# EAGLE design WATER LEVEL INDICATOR (EAGLE 7.5.0)
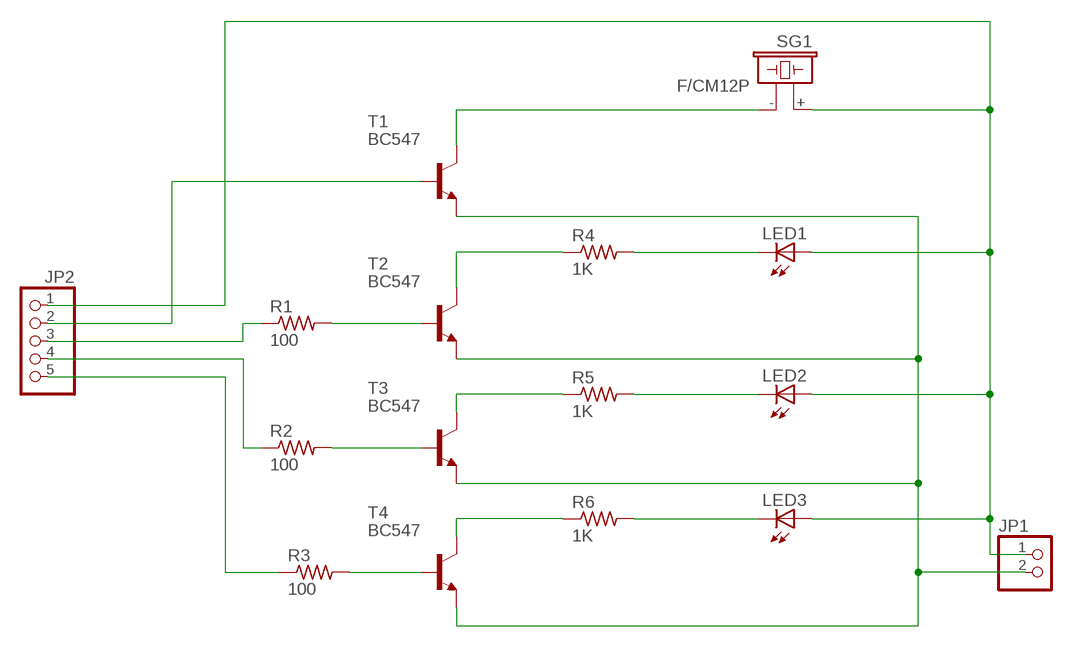
[diagram p0: schematic, sheet 1]

## Parts
JP1  PINHD-1X2  [1X02]
JP2  PINHD-1X5  [1X05]
LED1  LED5MM  [LED5MM]
LED2  LED5MM  [LED5MM]
LED3  LED5MM  [LED5MM]
R1  100  R-US_0207/10  [0207/10]
R2  100  R-US_0207/10  [0207/10]
R3  100  R-US_0207/10  [0207/10]
R4  1K  R-US_0207/10  [0207/10]
R5  1K  R-US_0207/10  [0207/10]
R6  1K  R-US_0207/10  [0207/10]
SG1  F/CM12P  [F/CM12P]
T1  BC547  [TO92]
T2  BC547  [TO92]
T3  BC547  [TO92]
T4  BC547  [TO92]

## Nets
N$1: LED1.K(C) R4.2
N$2: JP2.2 T1.2(B)
N$3: SG1.- T1.3(C)
N$4: JP2.3 R1.1
N$5: R1.2 T2.2(B)
N$6: R4.1 T2.3(C)
N$7: LED2.K(C) R5.2
N$8: JP2.4 R2.1
N$9: R2.2 T3.2(B)
N$10: R5.1 T3.3(C)
N$11: LED3.K(C) R6.2
N$12: JP1.1 JP2.1 LED1.A LED2.A LED3.A SG1.+
N$13: JP2.5 R3.1
N$14: R3.2 T4.2(B)
N$15: R6.1 T4.3(C)
N$17: JP1.2 T1.1(E) T2.1(E) T3.1(E) T4.1(E)

## Library data of the parts
JP1 = pinhead:PINHD-1X2: PIN HEADER
JP2 = pinhead:PINHD-1X5: PIN HEADER
LED1-LED3 = led:LED: LED OSRAM: - CHIPLED LG R971, LG N971, LY N971, LG Q971, LY Q971, LO R971, LY R971 LH N974, LH R974 LS Q976, LO Q976, LY Q976 LO Q996 - Hyper CHIPLED LW Q18S LB Q993, LB Q99A, LB R99A - SideLED LS A670, LO A670, LY A670, LG A670, LP A670 LB A673, LV A673, LT A673, LW A673 LH A674 LY A675 LS A676, LA A676, LO A676, LY A676, LW A676 LS A679, LY A679, LG A679 - Hyper Micro SIDELED® LS Y876, LA Y876, LO Y876, LY Y876 LT Y87S - SmartLED LW L88C, LW L88S LB L89C, LB L89S, LG L890 LS L89K, LO L89K, LY L89K LS L896, LA L896, LO L896, LY L896 - TOPLED LS T670, LO T670, LY T670, LG T670, LP T670 LSG T670, LSP T670, LSY T670, LOP T670, LYG T670 LG T671, LOG T671, LSG T671 LB T673, LV T673, LT T673, LW T673 LH T674 LS T676, LA T676, LO T676, LY T676, LB T676, LH T676, LSB T676, LW T676 LB T67C, LV T67C, LT T67C, LS T67K, LO T67K, LY T67K, LW E67C LS E67B, LA E67B, LO E67B, LY E67B, LB E67C, LV E67C, LT E67C LW T67C LS T679, LY T679, LG T679 LS T770, LO T770, LY T770, LG T770, LP T770 LB T773, LV T773, LT T773, LW T773 LH T774 LS E675, LA E675, LY E675, LS T675 LS T776, LA T776, LO T776, LY T776, LB T776 LHGB T686 LT T68C, LB T68C - Hyper Mini TOPLED® LB M676 - Mini TOPLED Santana® LG M470 LS M47K, LO M47K, LY M47K Source: http://www.osram.convergy.de LUXEON: - LUMILED® LXK2-PW12-R00, LXK2-PW12-S00, LXK2-PW14-U00, LXK2-PW14-V00 LXK2-PM12-R00, LXK2-PM12-S00, LXK2-PM14-U00 LXK2-PE12-Q00, LXK2-PE12-R00, LXK2-PE12-S00, LXK2-PE14-T00, LXK2-PE14-U00 LXK2-PB12-K00, LXK2-PB12-L00, LXK2-PB12-M00, LXK2-PB14-N00, LXK2-PB14-P00, LXK2-PB14-Q00 LXK2-PR12-L00, LXK2-PR12-M00, LXK2-PR14-Q00, LXK2-PR14-R00 LXK2-PD12-Q00, LXK2-PD12-R00, LXK2-PD12-S00 LXK2-PH12-R00, LXK2-PH12-S00 LXK2-PL12-P00, LXK2-PL12-Q00, LXK2-PL12-R00 Source: www.luxeon.com KINGBRIGHT: KA-3528ASYC Source: www.kingbright.com
R1-R6 = rcl:R-US_: RESISTOR, American symbol
SG1 = buzzer:F/CM12P: BUZZER Source: Buerklin; OC_FARNELL: unknown; OC_NEWARK: unknown
T1-T4 = transistor:BC547: NPN TRANSISTOR

## Board
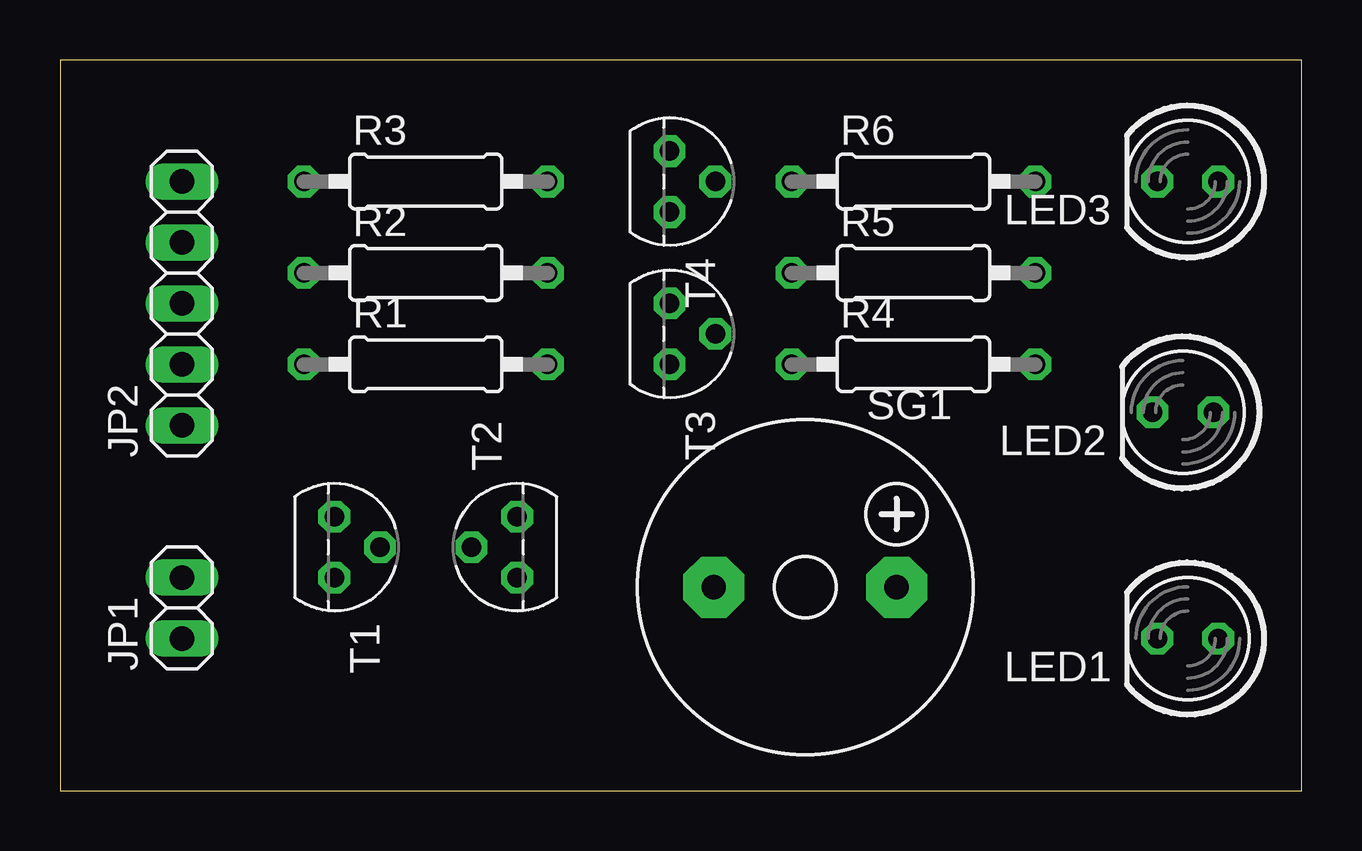
[diagram p1: board, top side]
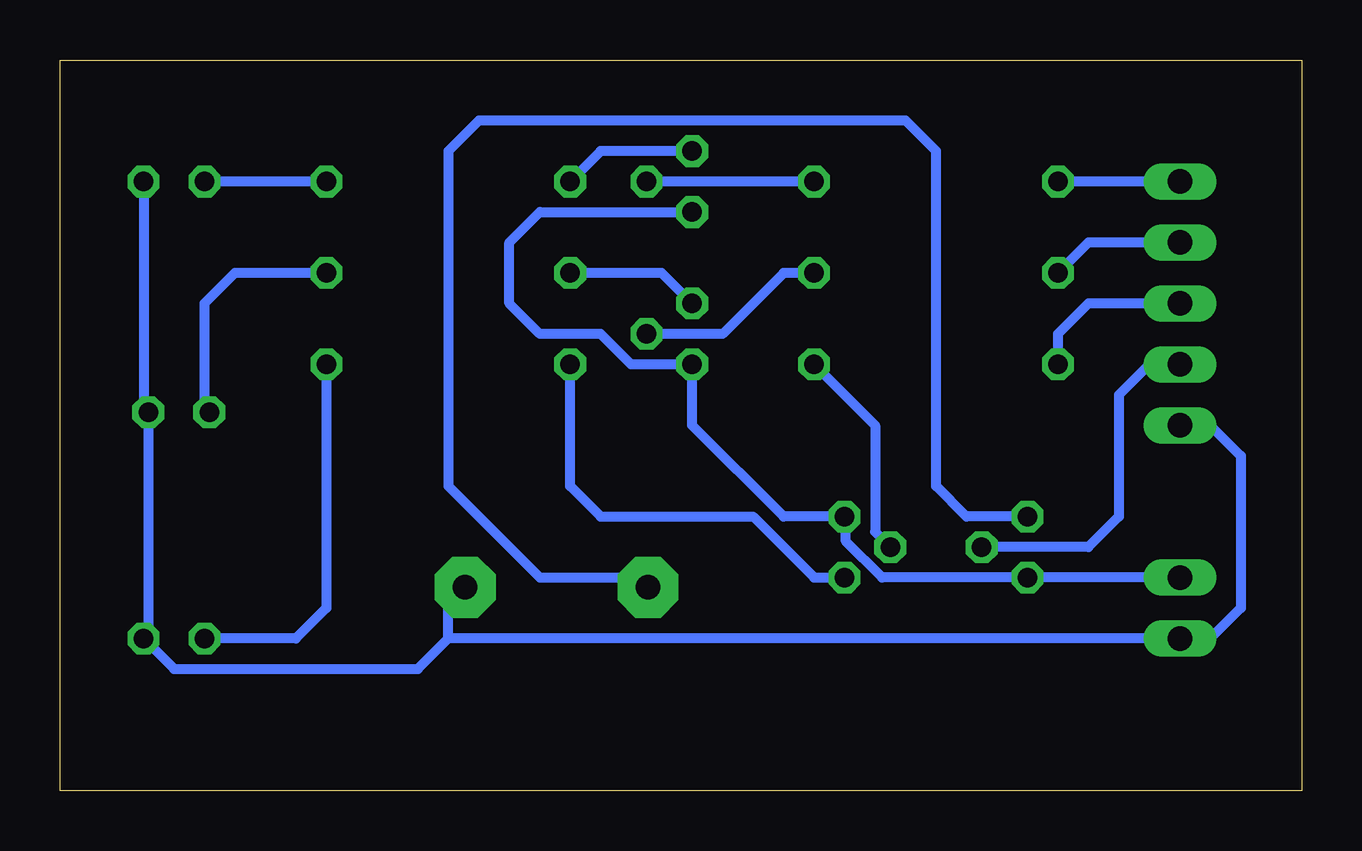
[diagram p2: board, bottom side, seen from below]

Size 51.74 x 30.47 mm. Coordinates in mm from the lower left corner, seen from the top.
Outline: 0,0 51.74,0 51.74,30.47 0,30.47 0,0
Copper layers (1*16): Top 0.035mm / dielectric 1.5mm / Bottom 0.035mm
Design rules "default": minimum track width 10mil, minimum drill 24mil, track to track 8mil, track to pad 8mil, pad to pad 8mil, via to via 8mil, smd to smd 8mil, copper to edge 40mil, drill to drill 8mil, minimum pad ring 10mil, minimum via ring 8mil, stop-mask expansion 4mil, vias tented up to drill 0mil, thermal gap 10mil

### Footprints (pad centres in the part's own frame; a part is rotated, then mirrored left to right if it is on the bottom)
1X02 = drill 1.016 long: 1 -1.27,0; 2 1.27,0
1X05 = drill 1.016 long: 1 -5.08,0; 2 -2.54,0; 3 0,0; 4 2.54,0; 5 5.08,0
LED5MM = drill 0.813 octagon: A -1.27,0; K 1.27,0
0207/10 = drill 0.813 octagon: 1 -5.08,0; 2 5.08,0
F/CM12P = drill 1.016 pad 2.54 octagon: + 3.81,0; - -3.81,0
TO92 = drill 0.813 octagon: 1 1.27,0; 2 0,1.905; 3 -1.27,0

### Placement (x,y rotation side)
JP1  5.08,7.62 90 top
JP2  5.08,20.32 90 top
LED1  46.99,6.35 180 top
LED2  46.79,15.78 180 top
LED3  46.99,25.4 180 top
R1  15.24,17.78 0 top
R2  15.24,21.59 0 top
R3  15.24,25.4 0 top
R4  35.56,17.78 0 top
R5  35.56,21.59 0 top
R6  35.56,25.4 0 top
SG1  31.05,8.49 0 top
T1  11.43,10.16 270 top
T2  19.05,10.16 90 top
T3  25.4,19.05 270 top
T4  25.4,25.4 270 top

### Tracks (layer width: path | path; a pad name or v marks a point on that pad's centre or on a via)
N$1
  Bottom 0.406: R4.2 40.64,7.62 41.91,6.35 LED1.K
N$2
  Bottom 0.406: JP2.2 6.35,17.78 7.62,16.51 7.62,11.43 8.89,10.16 T1.2
N$3
  Bottom 0.406: SG1.- 27.64,8.89 31.75,8.89 35.56,12.7 35.56,26.67 34.29,27.94 16.51,27.94 15.24,26.67 15.24,12.7 13.97,11.43 T1.3
N$4
  Bottom 0.406: JP2.3 8.89,20.32 10.16,19.05 R1.1
N$5
  Bottom 0.406: R1.2 17.78,15.24 17.78,10.79 T2.2
N$6
  Bottom 0.406: R4.1 30.48,12.7 29.21,11.43 22.86,11.43 20.32,8.89 T2.3
N$7
  Bottom 0.406: R5.2 44.45,21.59 45.72,20.32 45.72,15.98 LED2.K
N$8
  Bottom 0.406: JP2.4 8.89,22.86 R2.1
N$9
  Bottom 0.406: R2.2 21.59,21.59 24.13,19.05 T3.2
N$10
  Bottom 0.406: T3.3 26.67,21.59 R5.1
N$11
  Bottom 0.406: R6.2 LED3.K
N$12
  Bottom 0.406: LED3.A 48.26,15.98 LED2.A 48.06,6.55 LED1.A 46.99,5.08 36.83,5.08 35.56,6.35 | 35.56,6.35 35.56,7.79 SG1.+ | 35.56,6.35 JP1.1 3.81,6.35 2.54,7.62 2.54,13.97 3.81,15.24 JP2.1
N$13
  Bottom 0.406: JP2.5 R3.1
N$14
  Bottom 0.406: R3.2 T4.2
N$15
  Bottom 0.406: T4.3 29.21,26.67 R6.1
N$17
  Bottom 0.406: T4.1 31.75,24.13 33.02,22.86 33.02,20.32 31.75,19.05 29.21,19.05 27.94,17.78 T3.1 25.4,15.24 21.59,11.43 T2.1 19,11.38 19,10.4 17.49,8.89 T1.1 JP1.2